# EAGLE design laserrange_1_0_digital (EAGLE 6.1)
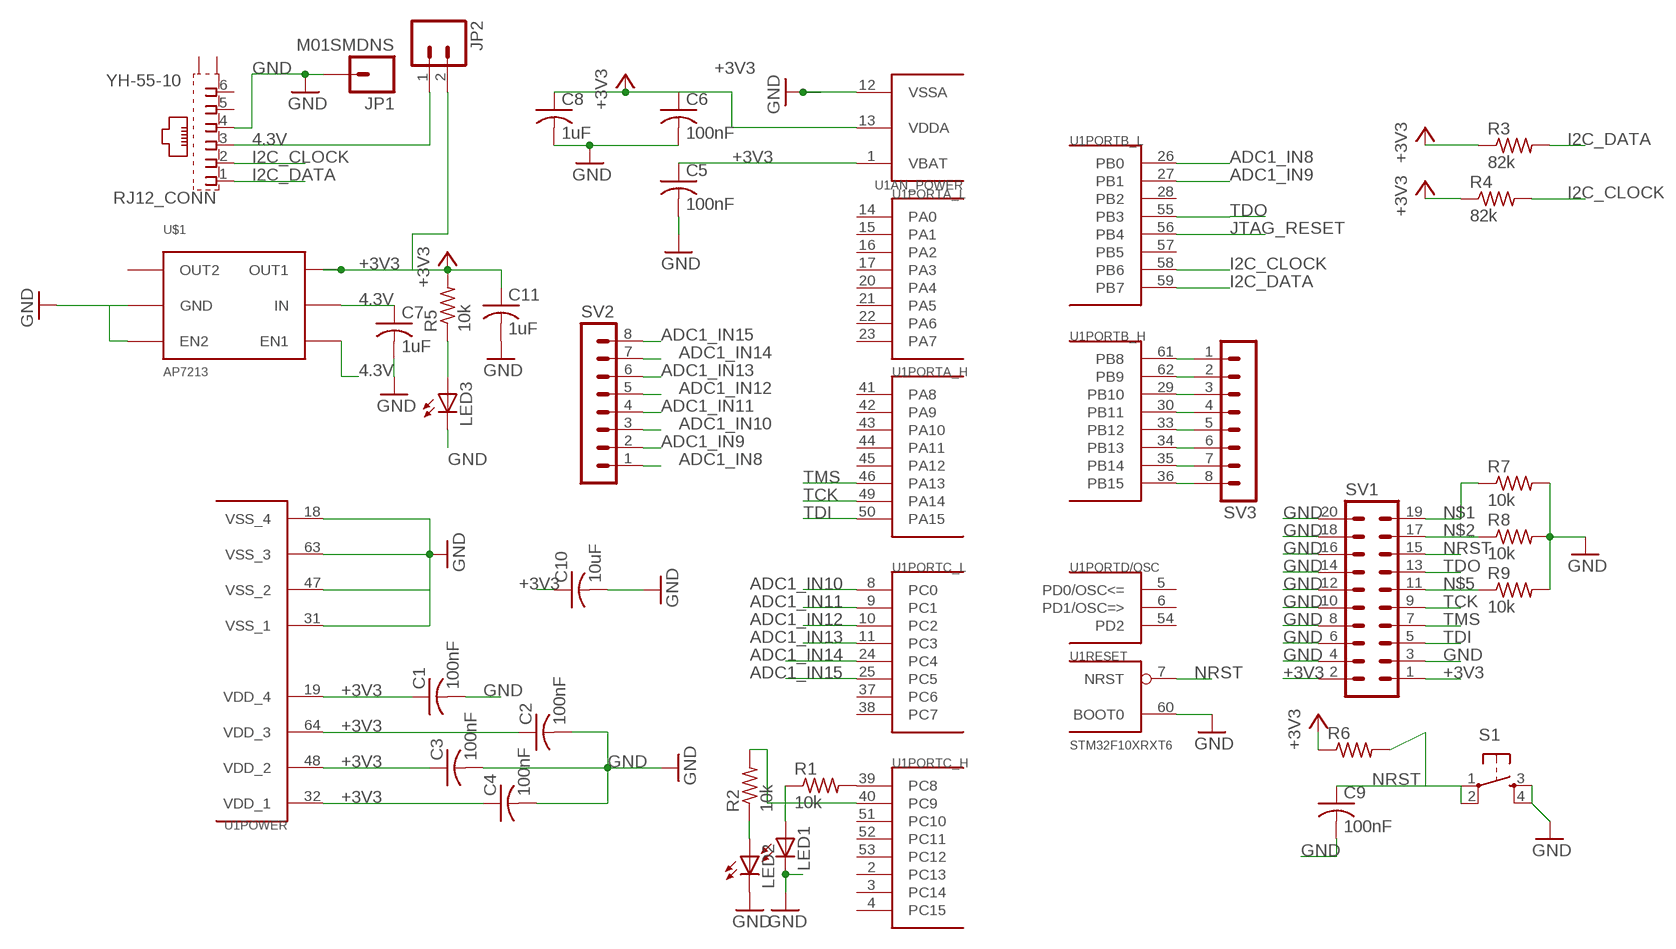
[diagram p0: schematic, sheet 1]

## Parts
C1  100nF  C-USC0603  [C0603]
C2  100nF  C-USC0603  [C0603]
C3  100nF  C-USC0603  [C0603]
C4  100nF  C-USC0603  [C0603]
C5  100nF  C-USC0603  [C0603]
C6  100nF  C-USC0603  [C0603]
C7  1uF  C-USC0603  [C0603]
C8  1uF  C-USC0603  [C0603]
C9  100nF  C-USC0603  [C0603]
C10  10uF  C-USC0805  [C0805]
C11  1uF  C-USC0603  [C0603]
JP1  M01SMDNS  [1X01NS]
JP2  M02PTH  [1X02]
LED1  LEDCHIPLED_0805  [CHIPLED_0805]
LED2  LEDCHIPLED_0805  [CHIPLED_0805]
LED3  LEDCHIPLED_0805  [CHIPLED_0805]
R1  10k  R-US_R0805  [R0805]
R2  10k  R-US_R0805  [R0805]
R3  82k  R-US_R0805  [R0805]
R4  82k  R-US_R0805  [R0805]
R5  10k  R-US_R0805  [R0805]
R6  R-US_R0805  [R0805]
R7  10k  R-US_R0805  [R0805]
R8  10k  R-US_R0805  [R0805]
R9  10k  R-US_R0805  [R0805]
RJ12_CONN  YH-55-10  [YH-55-10]
S1  TAC_SWITCHPTH  [TACTILE-PTH]
SV1  MA10-2  [MA10-2]
SV2  MA08-1  [MA08-1]
SV3  MA08-1  [MA08-1]
U1  STM32F10XRXT6  [TQFP64]
U$1  AP7213  [SOT23-6]

## Nets
4.3V: C7.1 JP2.1 RJ12_CONN.3 U$1.4(EN1) U$1.5(IN)
+3V3: C1.1 C2.1 C3.1 C4.1 C5.1 C6.1 C8.1 C10.1 C11.1 JP2.2 R3.1 R4.1 R5.2 R6.1 SV1.1 SV1.2 U1.1(AN_POWER:VBAT) U1.13(AN_POWER:VDDA) U1.19(POWER:VDD_4) U1.32(POWER:VDD_1) U1.48(POWER:VDD_2) U1.64(POWER:VDD_3) U$1.6(OUT1)
ADC1_IN8: SV2.1 U1.26(PORTB_L:PB0)
ADC1_IN9: SV2.2 U1.27(PORTB_L:PB1)
ADC1_IN10: SV2.3 U1.8(PORTC_L:PC0)
ADC1_IN11: SV2.4 U1.9(PORTC_L:PC1)
ADC1_IN12: SV2.5 U1.10(PORTC_L:PC2)
ADC1_IN13: SV2.6 U1.11(PORTC_L:PC3)
ADC1_IN14: SV2.7 U1.24(PORTC_L:PC4)
ADC1_IN15: SV2.8 U1.25(PORTC_L:PC5)
GND: C1.2 C2.2 C3.2 C4.2 C5.2 C6.2 C7.2 C8.2 C9.2 C10.2 C11.2 JP1.1 LED1.C LED2.C LED3.C R7.2 R8.2 R9.2 RJ12_CONN.4 S1.3 S1.4 SV1.3 SV1.4 SV1.6 SV1.8 SV1.10 SV1.12 SV1.14 SV1.16 SV1.18 SV1.20 U1.12(AN_POWER:VSSA) U1.18(POWER:VSS_4) U1.31(POWER:VSS_1) U1.47(POWER:VSS_2) U1.60(RESET:BOOT0) U1.63(POWER:VSS_3) U$1.2(GND) U$1.3(EN2)
I2C_CLOCK: R4.2 RJ12_CONN.2 U1.58(PORTB_L:PB6)
I2C_DATA: R3.2 RJ12_CONN.1 U1.59(PORTB_L:PB7)
JTAG_RESET: U1.56(PORTB_L:PB4)
N$1: R7.1 SV1.19
N$2: R8.1 SV1.17
N$3: SV3.1 U1.61(PORTB_H:PB8)
N$4: SV3.2 U1.62(PORTB_H:PB9)
N$5: R9.1 SV1.11
N$6: SV3.3 U1.29(PORTB_H:PB10)
N$7: SV3.4 U1.30(PORTB_H:PB11)
N$8: SV3.5 U1.33(PORTB_H:PB12)
N$9: SV3.6 U1.34(PORTB_H:PB13)
N$10: SV3.7 U1.35(PORTB_H:PB14)
N$11: SV3.8 U1.36(PORTB_H:PB15)
N$13: R1.2 U1.39(PORTC_H:PC8)
N$14: LED1.A R1.1
N$15: LED3.A R5.1
N$16: LED2.A R2.1
N$17: R2.2 U1.40(PORTC_H:PC9)
NRST: C9.1 R6.2 S1.1 S1.2 SV1.15 U1.7(RESET:NRST)
TCK: SV1.9 U1.49(PORTA_H:PA14)
TDI: SV1.5 U1.50(PORTA_H:PA15)
TDO: SV1.13 U1.55(PORTB_L:PB3)
TMS: SV1.7 U1.46(PORTA_H:PA13)
Unconnected: RJ12_CONN.5 RJ12_CONN.6 RJ12_CONN.S1(S) RJ12_CONN.S2(S) U1.2(PORTC_H:PC13) U1.3(PORTC_H:PC14) U1.4(PORTC_H:PC15) U1.5(PORTD/OSC:PD0/OSC<=) U1.6(PORTD/OSC:PD1/OSC=>) U1.14(PORTA_L:PA0) U1.15(PORTA_L:PA1) U1.16(PORTA_L:PA2) U1.17(PORTA_L:PA3) U1.20(PORTA_L:PA4) U1.21(PORTA_L:PA5) U1.22(PORTA_L:PA6) U1.23(PORTA_L:PA7) U1.28(PORTB_L:PB2) U1.37(PORTC_L:PC6) U1.38(PORTC_L:PC7) U1.41(PORTA_H:PA8) U1.42(PORTA_H:PA9) U1.43(PORTA_H:PA10) U1.44(PORTA_H:PA11) U1.45(PORTA_H:PA12) U1.51(PORTC_H:PC10) U1.52(PORTC_H:PC11) U1.53(PORTC_H:PC12) U1.54(PORTD/OSC:PD2) U1.57(PORTB_L:PB5) U$1.1(OUT2)

## Library data of the parts
C1-C9 C11 = rcl:C-US: CAPACITOR, American symbol
C10 = resistor:C-US: CAPACITOR, American symbol
JP1 = SparkFun:M01: Header 1 Standard 1-pin 0.1" header. Use with straight break away headers (SKU : PRT-00116), right angle break away headers (PRT-00553), swiss pins (PRT-00743), machine pins (PRT-00117), and female headers (PRT-00115).
JP2 = SparkFun:M02: Header 2 Standard 2-pin 0.1" header. Use with straight break away headers (SKU : PRT-00116), right angle break away headers (PRT-00553), swiss pins (PRT-00743), machine pins (PRT-00117), and female headers (PRT-00115). Molex polarized connector foot print use with SKU : PRT-08233 with associated crimp pins and housings.
LED1-LED3 = led:LED: LED OSRAM: - CHIPLED LG R971, LG N971, LY N971, LG Q971, LY Q971, LO R971, LY R971 LH N974, LH R974 LS Q976, LO Q976, LY Q976 LO Q996 - Hyper CHIPLED LW Q18S LB Q993, LB Q99A, LB R99A - SideLED LS A670, LO A670, LY A670, LG A670, LP A670 LB A673, LV A673, LT A673, LW A673 LH A674 LY A675 LS A676, LA A676, LO A676, LY A676, LW A676 LS A679, LY A679, LG A679 - Hyper Micro SIDELED® LS Y876, LA Y876, LO Y876, LY Y876 LT Y87S - SmartLED LW L88C, LW L88S LB L89C, LB L89S, LG L890 LS L89K, LO L89K, LY L89K LS L896, LA L896, LO L896, LY L896 - TOPLED LS T670, LO T670, LY T670, LG T670, LP T670 LSG T670, LSP T670, LSY T670, LOP T670, LYG T670 LG T671, LOG T671, LSG T671 LB T673, LV T673, LT T673, LW T673 LH T674 LS T676, LA T676, LO T676, LY T676, LB T676, LH T676, LSB T676, LW T676 LB T67C, LV T67C, LT T67C, LS T67K, LO T67K, LY T67K, LW E67C LS E67B, LA E67B, LO E67B, LY E67B, LB E67C, LV E67C, LT E67C LW T67C LS T679, LY T679, LG T679 LS T770, LO T770, LY T770, LG T770, LP T770 LB T773, LV T773, LT T773, LW T773 LH T774 LS E675, LA E675, LY E675, LS T675 LS T776, LA T776, LO T776, LY T776, LB T776 LHGB T686 LT T68C, LB T68C - Hyper Mini TOPLED® LB M676 - Mini TOPLED Santana® LG M470 LS M47K, LO M47K, LY M47K Source: http://www.osram.convergy.de LUXEON: - LUMILED® LXK2-PW12-R00, LXK2-PW12-S00, LXK2-PW14-U00, LXK2-PW14-V00 LXK2-PM12-R00, LXK2-PM12-S00, LXK2-PM14-U00 LXK2-PE12-Q00, LXK2-PE12-R00, LXK2-PE12-S00, LXK2-PE14-T00, LXK2-PE14-U00 LXK2-PB12-K00, LXK2-PB12-L00, LXK2-PB12-M00, LXK2-PB14-N00, LXK2-PB14-P00, LXK2-PB14-Q00 LXK2-PR12-L00, LXK2-PR12-M00, LXK2-PR14-Q00, LXK2-PR14-R00 LXK2-PD12-Q00, LXK2-PD12-R00, LXK2-PD12-S00 LXK2-PH12-R00, LXK2-PH12-S00 LXK2-PL12-P00, LXK2-PL12-Q00, LXK2-PL12-R00 Source: www.luxeon.com KINGBRIGHT: KA-3528ASYC Source: www.kingbright.com
R1-R9 = resistor:R-US_: RESISTOR, American symbol
RJ12_CONN = con-wenzhou-yihua:YH-55-10: RJ11 6 connects Source: YH-55-10.pdf; OC_FARNELL: unknown; OC_NEWARK: unknown
S1 = SparkFun:TAC_SWITCH: Momentary Switch Button commonly used for reset or general input. Spark Fun Electronics SKU : COM-00097
SV1 = con-lstb:MA10-2: PIN HEADER; OC_FARNELL: unknown; OC_NEWARK: unknown
SV2 SV3 = con-lstb:MA08-1: PIN HEADER; OC_FARNELL: unknown; OC_NEWARK: unknown
U1 = stm32:STM32F10XRXT6: STM32F101/103 64pin LQFP
U$1 = DP1:AP7213

## Board
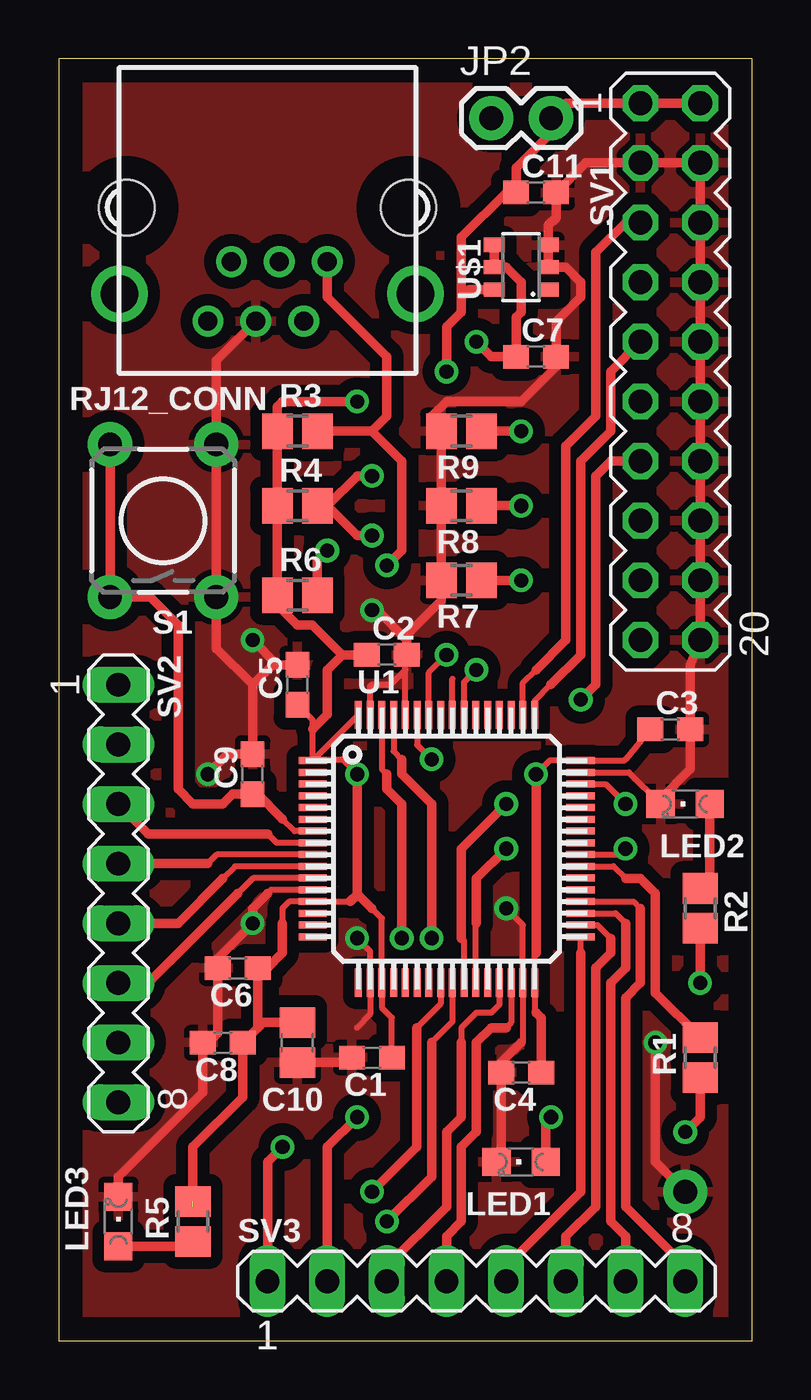
[diagram p1: board, top side]
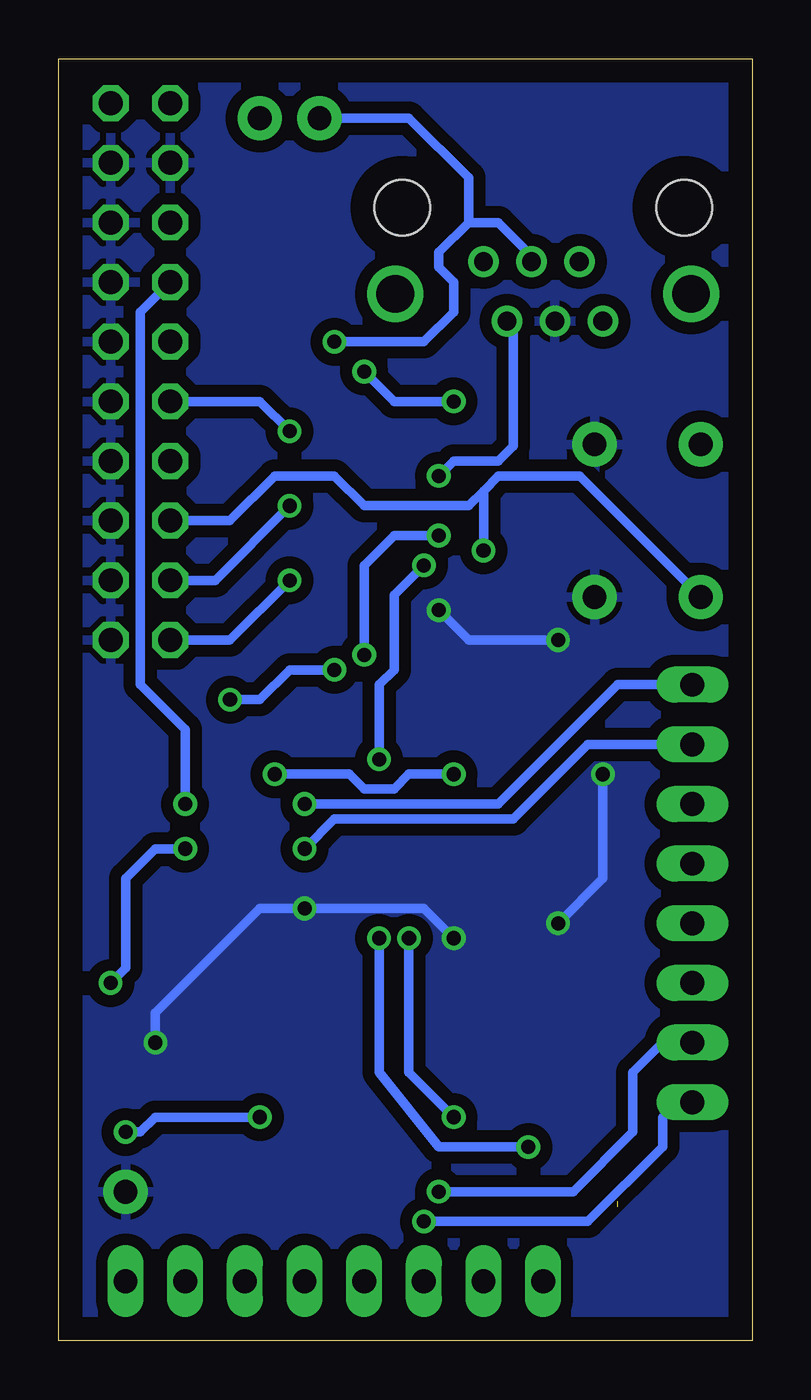
[diagram p2: board, bottom side, seen from below]

Size 29.52 x 54.6 mm. Coordinates in mm from the lower left corner, seen from the top.
Outline: 0,0 29.52,0 29.52,54.6 0,54.6 0,0
Copper layers (1*16): Top 0.035mm / dielectric 1.5mm / Bottom 0.035mm
Design rules: minimum track width 10mil, minimum drill 24mil, track to track 8mil, track to pad 8mil, pad to pad 6mil, via to via 8mil, smd to smd 8mil, copper to edge 40mil, drill to drill 8mil, minimum pad ring 10mil, minimum via ring 8mil, stop-mask expansion 4mil, vias tented up to drill 0mil, thermal gap 10mil

### Footprints (pad centres in the part's own frame; a part is rotated, then mirrored left to right if it is on the bottom)
C0603 = smd 1.1 x 1: 1 -0.85,0; 2 0.85,0
C0805 = smd 1.3 x 1.5: 1 -0.85,0; 2 0.85,0
1X01NS = drill 1.016 pad 1.88: 1 0,0
1X02 = drill 1.016 pad 1.88: 1 0,0; 2 2.54,0
CHIPLED_0805 = smd 1.2 x 1.2: A 0,-1.05; C 0,1.05
R0805 = smd 1.3 x 1.5: 1 -0.85,0; 2 0.85,0
YH-55-10 = drill 0.8 pad 1.3: 1 -2.54,2.3; 2 -1.54,4.84; 3 -0.5,2.3; 4 0.5,4.84; 5 1.54,2.3; 6 2.54,4.84 | drill 1.6 pad 2.184: S1 -6.3,3.68; S2 6.3,3.68 | hole 2.36: -6,0; 6,0
TACTILE-PTH = drill 1.016 pad 1.88: 1 -3.251,2.261; 2 3.251,2.261; 3 -3.251,-2.261; 4 3.251,-2.261
MA10-2 = drill 1.016 octagon: 1 -11.43,-1.27; 2 -11.43,1.27; 3 -8.89,-1.27; 4 -8.89,1.27; 5 -6.35,-1.27; 6 -6.35,1.27; 7 -3.81,-1.27; 8 -3.81,1.27; 9 -1.27,-1.27; 10 -1.27,1.27; 11 1.27,-1.27; 12 1.27,1.27; 13 3.81,-1.27; 14 3.81,1.27; 15 6.35,-1.27; 16 6.35,1.27; 17 8.89,-1.27; 18 8.89,1.27; 19 11.43,-1.27; 20 11.43,1.27
MA08-1 = drill 1.016 long: 1 -8.89,0; 2 -6.35,0; 3 -3.81,0; 4 -1.27,0; 5 1.27,0; 6 3.81,0; 7 6.35,0; 8 8.89,0
TQFP64 = smd 1.2 x 0.3: 1 -5.7,3.75; 2 -5.7,3.25; 3 -5.7,2.75; 4 -5.7,2.25; 5 -5.7,1.75; 6 -5.7,1.25; 7 -5.7,0.75; 8 -5.7,0.25; 9 -5.7,-0.25; 10 -5.7,-0.75; 11 -5.7,-1.25; 12 -5.7,-1.75; 13 -5.7,-2.25; 14 -5.7,-2.75; 15 -5.7,-3.25; 16 -5.7,-3.75; 33 5.7,-3.75; 34 5.7,-3.25; 35 5.7,-2.75; 36 5.7,-2.25; 37 5.7,-1.75; 38 5.7,-1.25; 39 5.7,-0.75; 40 5.7,-0.25; 41 5.7,0.25; 42 5.7,0.75; 43 5.7,1.25; 44 5.7,1.75; 45 5.7,2.25; 46 5.7,2.75; 47 5.7,3.25; 48 5.7,3.75 | smd 0.3 x 1.2: 17 -3.75,-5.7; 18 -3.25,-5.7; 19 -2.75,-5.7; 20 -2.25,-5.7; 21 -1.75,-5.7; 22 -1.25,-5.7; 23 -0.75,-5.7; 24 -0.25,-5.7; 25 0.25,-5.7; 26 0.75,-5.7; 27 1.25,-5.7; 28 1.75,-5.7; 29 2.25,-5.7; 30 2.75,-5.7; 31 3.25,-5.7; 32 3.75,-5.7; 49 3.75,5.7; 50 3.25,5.7; 51 2.75,5.7; 52 2.25,5.7; 53 1.75,5.7; 54 1.25,5.7; 55 0.75,5.7; 56 0.25,5.7; 57 -0.25,5.7; 58 -0.75,5.7; 59 -1.25,5.7; 60 -1.75,5.7; 61 -2.25,5.7; 62 -2.75,5.7; 63 -3.25,5.7; 64 -3.75,5.7
SOT23-6 = smd 0.6 x 0.9: 1 -0.95,-1.15; 2 0,-1.15; 3 0.95,-1.15; 4 0.95,1.15; 5 0,1.15; 6 -0.95,1.15

### Placement (x,y rotation side)
C1  13.34,12.06 180 top
C2  13.97,29.21 0 top
C3  26.04,26.04 0 top
C4  19.68,11.43 180 top
C5  10.16,27.94 90 top
C6  7.62,15.88 180 top
C7  20.32,41.91 0 top
C8  6.99,12.7 180.1 top
C9  8.26,24.13 90 top
C10  10.16,12.7 270 top
C11  20.32,48.9 0 top
JP1  26.67,6.35 0 top
JP2  18.41,52.07 0 top
LED1  19.68,7.62 90 top
LED2  26.67,22.86 90 top
LED3  2.54,5.08 0 top
R1  27.3,12.06 90 top
R2  27.3,18.41 270 top
R3  10.16,38.73 0 top
R4  10.16,35.56 0 top
R5  5.71,5.08 90 top
R6  10.16,31.75 0 top
R7  17.14,32.38 180 top
R8  17.14,35.56 180 top
R9  17.14,38.73 180 top
RJ12_CONN  8.89,48.26 180 top
S1  4.45,34.92 90 top
SV1  26.04,41.27 270 top
SV2  2.54,19.05 270 top
SV3  17.78,2.54 0 top
U1  16.51,20.95 0 top
U$1  19.68,45.72 90 top

### Tracks (layer width: path | path; a pad name or v marks a point on that pad's centre or on a via)
4.3V  (via drill 0.6)
  Top 0.406: U$1.4 U$1.5 19.05,45.72 19.68,45.09 19.68,43.81 19.47,43.6 C7.1 18.41,41.91 v17.78,42.55
  Bottom 0.406: RJ12_CONN.3 9.39,46.22 10.79,47.62 12.06,47.62 | 12.06,47.62 13.34,46.35 13.34,45.72 12.7,45.09 12.7,43.81 13.97,42.55 v17.78,42.55 | JP2.1 14.61,52.07 12.06,49.53 12.06,47.62
+3V3  (via drill 0.6)  (1 unrouted)
  Top 0.254: C1.1 14.19,13.76 13.76,14.18 U1.19 13.76,17.99 13.34,18.41 | C5.1 10.81,26.44 10.81,26.05 U1.1 | U1.64 U1.1 | C3.1 24.13,24.77 24.07,24.7 U1.48 20.89,24.7 v20.32,24.13 | 20.32,13.97 20.26,14.03 U1.32 20.26,16.45 20.32,16.51 | 9.53,17.78 9.53,18.41 9.81,18.7 U1.13 12.41,18.7 | U1.1 10.87,24.77 12.06,24.77 v12.7,24.13
  Top 0.406: 8.47,13.34 C6.1 8.89,15.88 9.53,16.51 9.53,17.78 | 8.47,13.34 C8.1 7.83,10.38 5.71,8.26 5.71,5.71 | SV1.2 SV1.1 21.59,52.7 JP2.2 20.95,51.44 19.47,49.95 C11.1 19.05,48.9 17.14,46.99 17.14,44.45 | C4.1 20.54,13.76 20.32,13.97 | C2.1 12.06,29.21 | 12.06,29.21 11.43,28.57 11.43,26.67 10.81,26.05 | C10.1 8.68,13.55 8.47,13.34 | v12.7,24.13 12.7,19 | 12.7,19 12.41,18.7 | 20.32,16.51 v20.32,24.13 | v12.7,40.01 9.53,40.01 9.31,39.79 R3.1 R4.1 R6.1 9.31,31.33 10.16,30.48 10.79,30.48 12.06,29.21 | v16.51,41.27 16.51,43.18 17.14,43.81 17.14,44.45 | 12.7,19 12.76,19 13.34,18.41 | U$1.6 17.46,44.77 17.14,44.45
  Bottom 0.406: v20.32,24.13 17.14,24.13 16.51,23.5 15.24,23.5 14.61,24.13 v12.7,24.13 | v12.7,40.01 15.24,40.01 v16.51,41.27
ADC1_IN8  (via drill 0.6)
  Top 0.254: U1.26 17.26,17.03 17.14,17.14
  Top 0.406: v19.05,22.86 17.14,20.95 17.14,17.14
  Bottom 0.406: SV2.1 5.71,27.94 10.79,22.86 v19.05,22.86
ADC1_IN9  (via drill 0.6)
  Top 0.254: U1.27 17.76,17.76 17.78,17.78
  Top 0.406: v19.05,20.95 17.78,19.68 17.78,17.78
  Bottom 0.406: SV2.2 6.99,25.4 10.16,22.23 17.78,22.23 v19.05,20.95
ADC1_IN10
  Top 0.254: U1.8 9.28,21.2 8.89,21.59
  Top 0.406: 8.89,21.59 3.81,21.59 SV2.3
ADC1_IN11
  Top 0.254: U1.9 6.74,20.7 6.35,20.32
  Top 0.406: 6.35,20.32 SV2.4
ADC1_IN12
  Top 0.254: U1.10 7.5,20.2 6.99,19.68
  Top 0.406: 6.99,19.68 5.08,17.78 SV2.5
ADC1_IN13
  Top 0.254: U1.11 8.28,19.7 7.62,19.05
  Top 0.406: 7.62,19.05 3.81,15.24 SV2.6
ADC1_IN14  (via drill 0.6)
  Top 0.254: U1.24 16.26,14.36 15.24,13.34
  Top 0.406: 15.24,13.34 15.24,8.26 v13.34,6.35
  Bottom 0.406: v13.34,6.35 7.62,6.35 5.08,8.89 5.08,11.43 3.81,12.7 SV2.7
ADC1_IN15  (via drill 0.6)
  Top 0.254: U1.25 16.76,13.59 15.88,12.7
  Top 0.406: 15.88,12.7 15.88,6.99 v13.97,5.08
  Bottom 0.406: v13.97,5.08 6.99,5.08 3.81,8.26 3.81,9.53 3.17,10.16 SV2.8
GND  (via drill 0.6)
  Top 0.254: U1.47 24.27,24.2 LED2.C | 19.68,12.7 19.76,12.78 U1.31 19.76,17.7 v19.05,18.41 | U1.12 9.04,19.2 8.89,19.05 | U1.60 14.76,28.57 | 14.76,28.57 14.76,29.15 C2.2 | 14.76,28.57 14.12,27.94 13.34,27.94 13.26,27.86 U1.63 | v12.7,17.14 13.26,16.59 U1.18 13.26,13.89 12.7,13.34
  Top 0.406: LED2.C 25.62,23.08 26.89,24.34 C3.2 26.89,28.79 SV1.20 SV1.18 SV1.16 SV1.14 SV1.12 SV1.10 SV1.8 SV1.6 SV1.4 SV1.3 22.44,50.16 C11.2 21.17,47.84 20.84,47.51 U$1.3 U$1.2 21.59,45.72 22.23,45.09 22.23,44.45 21.17,43.4 C7.2 21.17,41.49 19.68,40.01 16.51,40.01 15.88,39.37 15.88,39.16 R9.2 R8.2 R7.2 16.3,31.54 14.82,30.06 14.82,29.84 | LED1.C 18.84,7.82 C4.2 18.84,11.85 19.68,12.7 | 8.89,19.05 8.26,18.41 v8.26,17.78 6.77,16.3 C6.2 6.77,13.12 6.35,12.7 | 8.26,27.94 9.11,28.79 C5.2 9.31,28.79 v8.26,29.84 | 8.26,27.94 C9.2 7.2,24.98 v6.35,24.13 | 8.26,27.94 6.71,29.49 S1.3 S1.4 6.71,41.74 RJ12_CONN.4 | C8.2 6.13,10.58 2.54,6.99 LED3.C | C10.2 12.27,11.85 C1.2 | C2.2 14.82,29.84 | v13.34,31.11 13.55,31.11 14.82,29.84 | JP1.1 25.4,7.62 v25.4,12.7
  Bottom 0.406: v6.35,24.13 6.35,19.68 v8.26,17.78 | v8.26,29.84 12.06,29.84 v13.34,31.11 | v12.7,17.14 13.97,18.41 v19.05,18.41 20.95,18.41 25.4,13.97 v25.4,12.7
  pour Top (isolate 0.508): 0,54.61 29.21,54.61 29.21,0 0,0
  pour Bottom (isolate 0.508): 0,54.61 29.21,54.61 29.21,0 0,0
I2C_CLOCK  (via drill 0.6)
  Top 0.254: U1.58 15.76,28.46 v16.51,29.21
  Top 0.406: R4.2 11.43,35.56 | 11.43,35.56 12.7,34.29 v13.34,34.29 | 11.43,35.56 12.7,36.83 v13.34,36.83
  Bottom 0.406: v16.51,29.21 16.51,33.02 15.24,34.29 v13.34,34.29 | RJ12_CONN.2 10.16,43.15 10.16,38.1 10.79,37.47 12.7,37.47 v13.34,36.83
I2C_DATA  (via drill 0.6)
  Top 0.254: U1.59 15.26,25.38 v15.88,24.77
  Top 0.406: R3.2 13.34,38.73 | 13.34,38.73 14.61,37.47 14.61,33.66 v13.97,33.02 | RJ12_CONN.1 11.43,44.45 13.97,41.91 13.97,39.37 13.34,38.73
  Bottom 0.406: v15.88,24.77 15.88,27.94 15.24,28.57 15.24,31.75 v13.97,33.02
JTAG_RESET
  Top 0.254: U1.56 16.76,28.19
N$1  (via drill 0.6)
  Top 0.406: R7.1 v19.68,32.38
  Bottom 0.406: SV1.19 22.23,29.84 v19.68,32.38
N$2  (via drill 0.6)
  Top 0.406: R8.1 v19.68,35.56
  Bottom 0.406: SV1.17 22.86,32.38 v19.68,35.56
N$3  (via drill 0.6)
  Top 0.254: U1.61 14.26,25.11 14.61,24.77
  Top 0.406: v9.53,8.26 8.89,7.62 SV3.1 | 14.61,24.77 14.61,24.13 15.88,22.86 v15.88,17.14
  Bottom 0.406: v9.53,8.26 13.34,8.26 15.88,11.43 v15.88,17.14
N$4  (via drill 0.6)
  Top 0.254: U1.62 13.76,24.34 13.97,24.13
  Top 0.406: v12.7,9.53 11.43,8.26 SV3.2 | 13.97,24.13 13.97,23.5 14.61,22.86 v14.61,17.14
  Bottom 0.406: v12.7,9.53 14.61,11.43 v14.61,17.14
N$5  (via drill 0.6)
  Top 0.406: R9.1 v19.68,38.73
  Bottom 0.406: SV1.11 20.95,40.01 v19.68,38.73
N$6
  Top 0.254: U1.29 18.76,14.31 18.41,13.97 17.78,13.97 17.14,13.34 17.14,12.7
  Top 0.406: SV3.3 13.97,3.17 16.51,5.71 16.51,8.89 17.14,9.53 17.14,12.7
N$7
  Top 0.254: U1.30 19.26,13.54 19.05,13.34
  Top 0.406: SV3.4 16.51,4.45 17.14,5.08 17.14,8.26 17.78,8.89 17.78,12.7 18.41,13.34 19.05,13.34
N$8
  Top 0.254: U1.33 22.21,16.52 22.23,16.51
  Top 0.406: 22.23,16.51 22.23,6.35 19.05,3.17 SV3.5
N$9
  Top 0.254: U1.34 22.93,17.7 23.5,17.14
  Top 0.406: 23.5,17.14 23.5,16.51 22.86,15.88 22.86,5.71 21.59,4.45 SV3.6
N$10
  Top 0.254: U1.35 23.7,18.2 24.13,17.78
  Top 0.406: 24.13,17.78 24.13,15.88 23.5,15.24 23.5,5.08 24.13,4.45 SV3.7
N$11
  Top 0.254: U1.36 24.48,18.7 24.77,18.41
  Top 0.406: 24.77,18.41 24.77,15.24 24.13,14.61 24.13,5.71 26.67,3.17 SV3.8
N$13
  Top 0.254: U1.39 23.61,20.2 24.13,19.68
  Top 0.406: 24.13,19.68 24.77,19.68 25.4,19.05 25.4,14.82 R1.2
N$14  (via drill 0.6)
  Top 0.406: R1.1 27.3,9.53 v26.67,8.89 | LED1.A 20.73,9.3 v20.95,9.53
  Bottom 0.406: v26.67,8.89 26.04,8.89 25.4,9.53 v20.95,9.53
N$15
  Top 0.406: LED3.A 5.51,4.03 R5.1
N$16
  Top 0.406: LED2.A 27.72,19.68 R2.1
N$17  (via drill 0.6)
  Top 0.254: U1.40 23.88,20.7 v24.13,20.95
  Top 0.406: R2.2 v27.3,15.24
  Bottom 0.406: v24.13,20.95 25.4,20.95 26.67,19.68 26.67,15.88 v27.3,15.24
NRST  (via drill 0.6)
  Top 0.254: U1.7 10.04,21.7 9.53,22.23
  Top 0.406: S1.2 S1.1 3.89,31.67 5.08,30.48 5.08,23.5 5.71,22.86 6.99,22.86 7.41,23.28 C9.1 8.47,23.28 9.53,22.23 | R6.2 11.01,33.23 v11.43,33.66
  Bottom 0.406: SV1.15 22.23,34.92 20.32,36.83 17.78,36.83 16.51,35.56 12.06,35.56 11.43,36.2 | S1.1 7.34,36.83 10.79,36.83 11.43,36.2 | v11.43,33.66 11.43,36.2
TCK
  Top 0.254: U1.49 20.26,27.25 20.95,27.94
  Top 0.406: 20.95,27.94 22.23,29.21 22.23,37.47 23.5,38.73 23.5,41.27 SV1.9
TDI
  Top 0.254: U1.50 19.76,28.02 20.32,28.57
  Top 0.406: SV1.5 24.13,47.62 22.86,46.35 22.86,39.37 21.59,38.1 21.59,29.84 20.32,28.57
TDO  (via drill 0.6)
  Top 0.254: U1.55 17.26,28.05 v17.78,28.57
  Top 0.406: SV1.13 23.5,37.47 22.86,36.83 22.86,27.94 v22.23,27.3
  Bottom 0.406: v17.78,28.57 19.68,28.57 20.95,27.3 v22.23,27.3
TMS  (via drill 0.6)
  Top 0.254: U1.46 23.29,23.7 v24.13,22.86
  Bottom 0.406: v24.13,22.86 24.13,26.04 26.04,27.94 26.04,43.81 SV1.7